# EAGLE design eagle_eagle_Tiltaudio_3.6 (EAGLE 7.3.0)
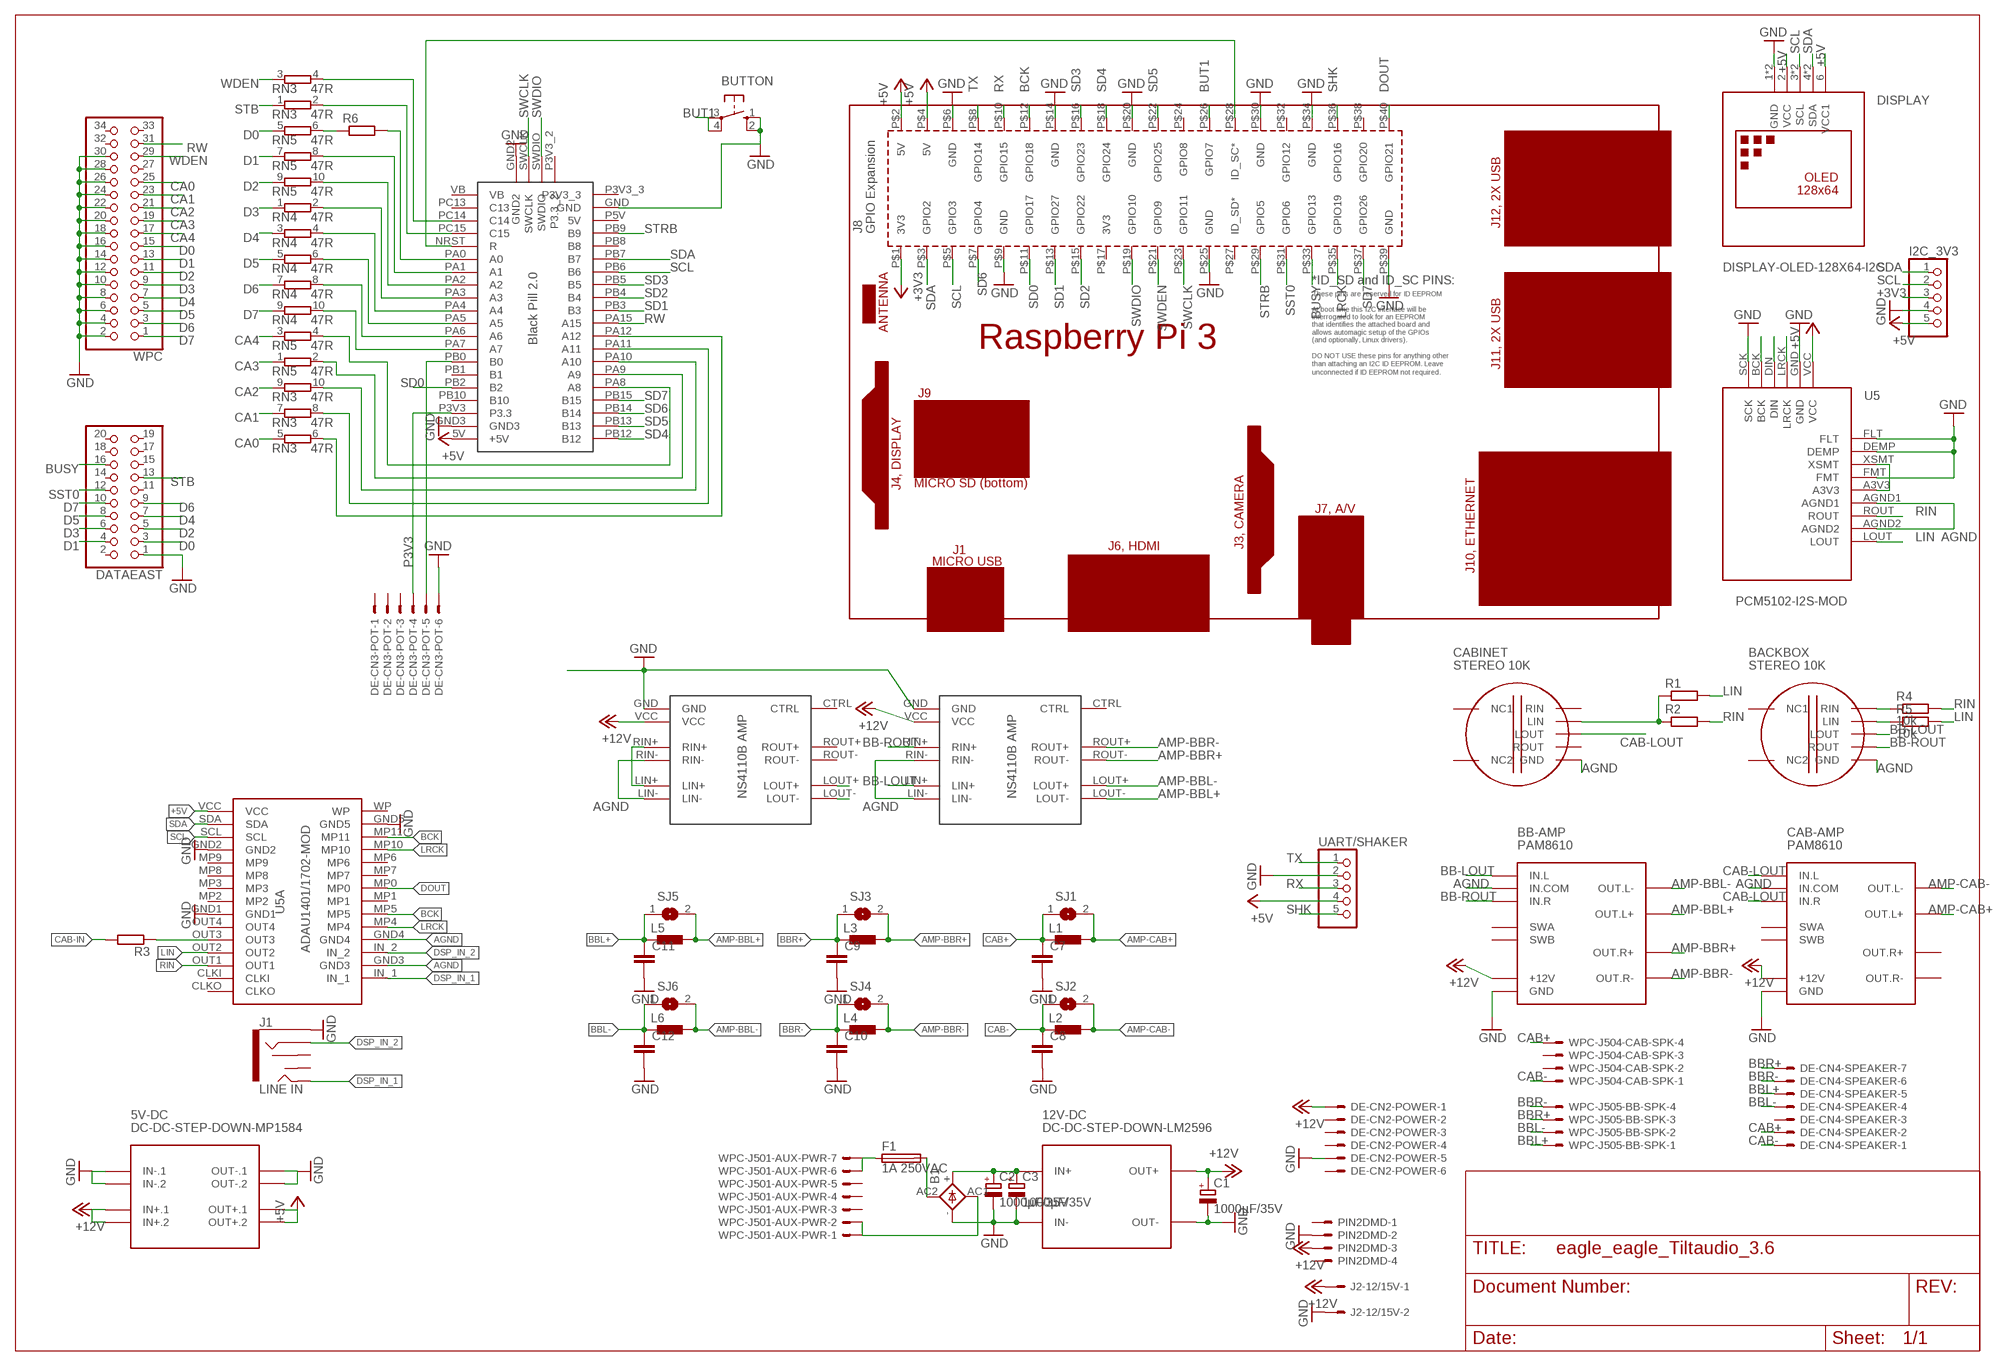
[diagram p0: schematic, sheet 1]

## Parts
5V-DC  DC-DC-STEP-DOWN-MP1584  [DC-DC-STEP-DOWN-MP1584]
12V-DC  DC-DC-STEP-DOWN-LM2596  [DC-DC-STEP-DOWN-LM2596]
B1  KBL  [KBL]
BACKBOX  STEREO 10K  UXCELL-STEREO-POTENTIOMETER  [UXCELL-STEREO-POTENTIOMETER]
BB-AMP  PAM8610  AMPLIFIER-PAM8610  [AMPLIFIER-PAM8610]
BUTTON  10-XX  [B3F-10XX]
C1  1000µF/35V  CPOL-EUE5-13  [E5-13]
C2  1000µF/35V  CPOL-EUE5-13  [E5-13]
C3  1000µF/35V  CPOL-EUE5-13  [E5-13]
C7  C-EU050-025X075  [C050-025X075]
C8  C-EU050-025X075  [C050-025X075]
C9  C-EU050-025X075  [C050-025X075]
C10  C-EU050-025X075  [C050-025X075]
C11  C-EU050-025X075  [C050-025X075]
C12  C-EU050-025X075  [C050-025X075]
CAB-AMP  PAM8610  AMPLIFIER-PAM8610  [AMPLIFIER-PAM8610]
CABINET  STEREO 10K  UXCELL-STEREO-POTENTIOMETER  [UXCELL-STEREO-POTENTIOMETER]
DATAEAST  PINHD-2X10  [2X10]
DE-CN2-POWER  KK-156-6  [KK-156-6]
DE-CN3-POT  KK-156-6  [KK-156-6]
DE-CN4-SPEAKER  KK-156-7  [KK-156-7]
DISPLAY  DISPLAY-OLED-128X64-I2C  [DISPLAY-OLED-128X64-I2C]
F1  1A 250VAC  FUSESHK20L  [SHK20L]
I2C_3V3  PINHD-1X5  [1X05]
J1  LINE IN  AUDIO_JACK_3.5MM_PTH  [AUDIO-JACK]
J2-12/15V  KK-156-2  [KK-156-2]
L1  BL02RN1  [BL02RN1]
L2  BL02RN1  [BL02RN1]
L3  BL02RN1  [BL02RN1]
L4  BL02RN1  [BL02RN1]
L5  BL02RN1  [BL02RN1]
L6  BL02RN1  [BL02RN1]
MPU1  Raspberry Pi3  RPI3RPI3MIRROR  [RPI3MIRROR]
PIN2DMD  KK-156-4  [KK-156-4]
R1  R-EU_0207/10  [0207/10]
R2  R-EU_0207/10  [0207/10]
R3  R-EU_0207/10  [0207/10]
R4  10k  R-EU_0207/10  [0207/10]
R5  10k  R-EU_0207/10  [0207/10]
R6  R-EU_0207/12  [0207/12]
RN3  47R  E5RP  [SIL10]
RN4  47R  E5RP  [SIL10]
RN5  47R  E5RP  [SIL10]
SJ1  SJ  [SJ]
SJ2  SJ  [SJ]
SJ3  SJ  [SJ]
SJ4  SJ  [SJ]
SJ5  SJ  [SJ]
SJ6  SJ  [SJ]
U5  PCM5102-I2S-MOD  [PCM5102-I2S-MOD]
U5A  ADAU1401/1702-MOD  [ADAU1401/1701-MOD]
U$1  STM32F411CE-BLACKPILL  [DIL40]
U$2  DAMP  [DAMP]
U$3  DAMP  [DAMP]
UART/SHAKER  PINHD-1X5  [1X05]
WPC  PINHD-2X17  [2X17]
WPC-J501-AUX-PWR  KK-156-7  [KK-156-7]
WPC-J504-CAB-SPK  KK-156-4  [KK-156-4]
WPC-J505-BB-SPK  KK-156-4  [KK-156-4]

## Nets
+3V3: I2C_3V3.3 MPU1.P$1(3V3)
+5V: 5V-DC.OUT+.1 5V-DC.OUT+.2 DISPLAY.2(VCC) DISPLAY.6(VCC1) I2C_3V3.5 MPU1.P$2(5V) MPU1.P$4(5V) U5.VCC U5A.VCC U$1.5V(+5V) UART/SHAKER.4
+12V: 5V-DC.IN+.1 5V-DC.IN+.2 12V-DC.OUT+ BB-AMP.+12V C1.+ CAB-AMP.+12V DE-CN2-POWER.1 J2-12/15V.1 PIN2DMD.3 U$2.VCC U$3.VCC
AGND: BACKBOX.GND BB-AMP.IN.COM CAB-AMP.IN.COM CABINET.GND U5.AGND1 U5.AGND2 U5A.GND3 U5A.GND4 U$2.LIN- U$2.RIN- U$3.LIN- U$3.RIN-
AMP-BBL+: BB-AMP.OUT.L+ L5.2 SJ5.2 U$2.LOUT-
AMP-BBL-: BB-AMP.OUT.L- L6.2 SJ6.2 U$2.LOUT+
AMP-BBR+: BB-AMP.OUT.R+ L3.2 SJ3.2 U$2.ROUT-
AMP-BBR-: BB-AMP.OUT.R- L4.2 SJ4.2 U$2.ROUT+
AMP-CAB+: CAB-AMP.OUT.L+ L1.2 SJ1.2 U$3.LOUT-
AMP-CAB-: CAB-AMP.OUT.L- L2.2 SJ2.2 U$3.LOUT+
BB-LIN: BACKBOX.LIN R5.1
BB-LOUT: BACKBOX.LOUT BB-AMP.IN.L U$2.LIN+
BB-RIN: BACKBOX.RIN R4.1
BB-ROUT: BACKBOX.ROUT BB-AMP.IN.R U$2.RIN+
BBL+: C11.1 DE-CN4-SPEAKER.5 L5.1 SJ5.1 WPC-J505-BB-SPK.1
BBL-: C12.1 DE-CN4-SPEAKER.4 L6.1 SJ6.1 WPC-J505-BB-SPK.2
BBR+: C9.1 DE-CN4-SPEAKER.7 L3.1 SJ3.1 WPC-J505-BB-SPK.3
BBR-: C10.1 DE-CN4-SPEAKER.6 L4.1 SJ4.1 WPC-J505-BB-SPK.4
BCK: MPU1.P$12(GPIO18) U5.BCK U5A.MP5 U5A.MP11
BUSY: DATAEAST.16 MPU1.P$33(GPIO13)
BUT1: BUTTON.3(P) BUTTON.4(P1) MPU1.P$26(GPIO7)
CA0: RN3.5 WPC.25
CA1: RN3.7 WPC.23
CA2: RN3.9 WPC.21
CA3: RN5.1 WPC.19
CA4: RN5.3 WPC.17
CAB+: C7.1 DE-CN4-SPEAKER.2 L1.1 SJ1.1 WPC-J504-CAB-SPK.4
CAB-: C8.1 DE-CN4-SPEAKER.1 L2.1 SJ2.1 WPC-J504-CAB-SPK.1
CAB-IN: CABINET.LIN R1.1 R2.1 R3.2
CAB-LOUT: CAB-AMP.IN.L CAB-AMP.IN.R CABINET.LOUT U$3.LIN+ U$3.RIN+
D0: DATAEAST.3 RN5.5 WPC.15
D1: DATAEAST.4 RN5.7 WPC.13
D2: DATAEAST.5 RN5.9 WPC.11
D3: DATAEAST.6 RN4.1 WPC.9
D4: DATAEAST.7 RN4.3 WPC.7
D5: DATAEAST.8 RN4.5 WPC.5
D6: DATAEAST.9 RN4.7 WPC.3
D7: DATAEAST.10 RN4.9 WPC.1
DOUT: MPU1.P$40(GPIO21) U5.DIN U5A.MP0
DSP_IN_1: J1.TIP U5A.IN_1
DSP_IN_2: J1.RING U5A.IN_2
GND: 5V-DC.IN-.1 5V-DC.IN-.2 5V-DC.OUT-.1 5V-DC.OUT-.2 12V-DC.IN- 12V-DC.OUT- B1.- BB-AMP.GND BUTTON.1(S) BUTTON.2(S1) C1.- C2.- C3.- C7.2 C8.2 C9.2 C10.2 C11.2 C12.2 CAB-AMP.GND DATAEAST.1 DE-CN2-POWER.5 DE-CN3-POT.6 DISPLAY.1(GND) DISPLAY.5(GND) I2C_3V3.4 J1.SLEEVE J2-12/15V.2 MPU1.P$6(GND) MPU1.P$9(GND) MPU1.P$14(GND) MPU1.P$20(GND) MPU1.P$25(GND) MPU1.P$30(GND) MPU1.P$34(GND) MPU1.P$39(GND) PIN2DMD.2 U5.DEMP U5.FLT U5.FMT U5.GND U5.SCK U5A.GND1 U5A.GND2 U5A.GND5 U$1.GND U$1.GND2 U$1.GND3 U$2.GND U$3.GND UART/SHAKER.2 WPC.2 WPC.4 WPC.6 WPC.8 WPC.10 WPC.12 WPC.14 WPC.16 WPC.18 WPC.20 WPC.22 WPC.24 WPC.26 WPC.28 WPC.30
LIN: R1.2 R5.2 U5.LOUT U5A.OUT2
LRCK: MPU1.P$35(GPIO19) U5.LRCK U5A.MP4 U5A.MP10
N$1: MPU1.P$28(ID_SC*) U$1.NRST(R)
N$2: R3.1 U5A.OUT3
N$3: RN3.4 U$1.PC14(C14)
N$4: U5.A3V3 U5.XSMT
N$5: RN3.2 U$1.PC15(C15)
N$6: R6.2 U$1.PA0(A0)
N$7: RN5.8 U$1.PA1(A1)
N$8: RN5.10 U$1.PA2(A2)
N$9: B1.AC2(AC1) F1.2A
N$10: F1.1A WPC-J501-AUX-PWR.6 WPC-J501-AUX-PWR.7
N$11: B1.AC1(AC2) WPC-J501-AUX-PWR.1 WPC-J501-AUX-PWR.2
N$12: RN4.2 U$1.PA3(A3)
N$13: RN4.4 U$1.PA4(A4)
N$14: RN4.6 U$1.PA5(A5)
N$15: RN4.8 U$1.PA6(A6)
N$16: RN4.10 U$1.PA7(A7)
N$17: RN3.6 U$1.PA12(A12)
N$18: RN5.4 U$1.PA8(A8)
N$19: RN3.8 U$1.PA11(A11)
N$20: RN3.10 U$1.PA10(A10)
N$21: RN5.2 U$1.PA9(A9)
N$22: DE-CN3-POT.5 U$1.PB0(B0)
N$23: R6.1 RN5.6
N$26: 12V-DC.IN+ B1.+ C2.+ C3.+
P3V3: DE-CN3-POT.4 U$1.P3V3(P3.3)
RIN: R2.2 R4.2 U5.ROUT U5A.OUT1
RW: U$1.PA15(A15) WPC.31
RX: MPU1.P$10(GPIO15) UART/SHAKER.3
SCL: DISPLAY.3(SCL) DISPLAY.7(SCL) I2C_3V3.2 MPU1.P$5(GPIO3) U5A.SCL U$1.PB6(B6)
SD0: MPU1.P$11(GPIO17) U$1.PB2(B2)
SD1: MPU1.P$13(GPIO27) U$1.PB3(B3)
SD2: MPU1.P$15(GPIO22) U$1.PB4(B4)
SD3: MPU1.P$16(GPIO23) U$1.PB5(B5)
SD4: MPU1.P$18(GPIO24) U$1.PB12(B12)
SD5: MPU1.P$22(GPIO25) U$1.PB13(B13)
SD6: MPU1.P$7(GPIO4) U$1.PB14(B14)
SD7: MPU1.P$37(GPIO26) U$1.PB15(B15)
SDA: DISPLAY.4(SDA) DISPLAY.8(SDA) I2C_3V3.1 MPU1.P$3(GPIO2) U5A.SDA U$1.PB7(B7)
SHK: MPU1.P$36(GPIO16) UART/SHAKER.5
SST0: DATAEAST.12 MPU1.P$31(GPIO6)
STB: DATAEAST.13 RN3.1
STRB: MPU1.P$29(GPIO5) U$1.PB9(B9)
SWCLK: MPU1.P$23(GPIO11) U$1.SWCLK
SWDEN: MPU1.P$21(GPIO9)
SWDIO: MPU1.P$19(GPIO10) U$1.SWDIO
TX: MPU1.P$8(GPIO14) UART/SHAKER.1
WDEN: RN3.3 WPC.29
Unconnected: BACKBOX.NC1 BACKBOX.NC2 BB-AMP.SWA BB-AMP.SWB CAB-AMP.OUT.R+ CAB-AMP.OUT.R- CAB-AMP.SWA CAB-AMP.SWB CABINET.NC1 CABINET.NC2 CABINET.RIN CABINET.ROUT DATAEAST.2 DATAEAST.11 DATAEAST.14 DATAEAST.15 DATAEAST.17 DATAEAST.18 DATAEAST.19 DATAEAST.20 DE-CN2-POWER.2 DE-CN2-POWER.3 DE-CN2-POWER.4 DE-CN2-POWER.6 DE-CN3-POT.1 DE-CN3-POT.2 DE-CN3-POT.3 DE-CN4-SPEAKER.3 J1.RSH J1.TSH MPU1.P$17(3V3) MPU1.P$24(GPIO8) MPU1.P$27(ID_SD*) MPU1.P$32(GPIO12) MPU1.P$38(GPIO20) PIN2DMD.1 PIN2DMD.4 U5A.CLKI U5A.CLKO U5A.MP1 U5A.MP2 U5A.MP3 U5A.MP6 U5A.MP7 U5A.MP8 U5A.MP9 U5A.OUT4 U5A.WP U$1.P3V3_2(P3.3_2) U$1.P3V3_3 U$1.P5V(5V) U$1.PB1(B1) U$1.PB8(B8) U$1.PB10(B10) U$1.PC13(C13) U$1.VB U$2.CTRL U$3.CTRL U$3.ROUT+ U$3.ROUT- WPC-J501-AUX-PWR.3 WPC-J501-AUX-PWR.4 WPC-J501-AUX-PWR.5 WPC-J504-CAB-SPK.2 WPC-J504-CAB-SPK.3 WPC.27 WPC.32 WPC.33 WPC.34

## Library data of the parts
5V-DC = diy-modules:DC-DC-STEP-DOWN-MP1584: DC/DC Step-Down Regulator based on MP1584 chip MP1584 datasheet available here: http://www.haoyuelectronics.com/Attachment/MP1584/MP1584.pdf Click here to find device on ebay.com <http://www.ebay.com/sch/mp1584+module>
12V-DC = diy-modules:DC-DC-STEP-DOWN-LM2596: DC/DC Step-Down Regulator based on LM2596-ADJ chip LM2596 datasheet available here: http://www.ti.com/lit/ds/symlink/lm2596.pdf Click here to find device on ebay.com <http://www.ebay.com/sch/lm2596+power+regulator>
B1 = rectifier:KBL: DIOTEC RECTIFIER
BACKBOX CABINET = diy-modules:UXCELL-STEREO-POTENTIOMETER: UXCELL STEREO POTENTIOMETER
BB-AMP CAB-AMP = diy-modules:AMPLIFIER-PAM8610: Stereo Audio Amplifier based on PAM8610 chip
BUTTON = switch-omron:10-XX: OMRON SWITCH; MPN: B3F-1000; OC_FARNELL: 176432; OC_NEWARK: 36M3542
C1-C3 = rcl:CPOL-EU: POLARIZED CAPACITOR, European symbol
C7-C12 = rcl:C-EU: CAPACITOR, European symbol
DATAEAST = pinhead:PINHD-2X10: PIN HEADER
DE-CN2-POWER DE-CN3-POT = con-molex:KK-156-6: KK 156 HEADER Source: http://www.molex.com/pdm_docs/sd/026604100_sd.pdf; OC_FARNELL: unknown; OC_NEWARK: unknown
DE-CN4-SPEAKER WPC-J501-AUX-PWR = con-molex:KK-156-7: KK 156 HEADER Source: http://www.molex.com/pdm_docs/sd/026604100_sd.pdf; OC_FARNELL: unknown; OC_NEWARK: unknown
DISPLAY = diy-modules:DISPLAY-OLED-128X64-I2C: 128x64 Dot Matrix OLED Module based on SSD1306 chip Variant with I2C interface More details available here: http://www.instructables.com/id/Monochrome-096-i2c-OLED-display-with-arduino-SSD13/ SSD1306 datasheet: https://cdn-shop.adafruit.com/datasheets/SSD1306.pdf Click here to find device on ebay.com <http://www.ebay.com/sch/oled+display+128x64+iic> Note: There are two variants: I2C and SPI. Search for the proper version.
F1 = fuse:FUSE: Fuse; OC_FARNELL: unknown; OC_NEWARK: unknown
I2C_3V3 UART/SHAKER = pinhead:PINHD-1X5: PIN HEADER
J1 = SparkFun-Connectors:AUDIO_JACK_3.5MM: Audio Jack 3.5mm variants of PTH and SMT stereo audio jack with bypass switches. SparkFun Products: SparkFun SparkPunk Sound Kit <[https://www.sparkfun.com/products/11177]> - PTH MP3 Trigger <https://www.sparkfun.com/products/13720> -3.5mm SMD SparkFun PicoBoard <https://www.sparkfun.com/products/11888>- 2.5mm SMD; PROD_ID: CONN-08774; SF_ID: PRT-08032
J2-12/15V = con-molex:KK-156-2: KK 156 HEADER Source: http://www.molex.com/pdm_docs/sd/026604100_sd.pdf; OC_FARNELL: unknown; OC_NEWARK: unknown
L1-L6 = inductors:BL0: Noise Suppression Products/EMI Suppression Filters, Lead EMIFIL(R) Inductor Type Source: http://www.murata.com .. BL01RN1_DS.pdf
MPU1 = e14_Rpi3_RevA+mirror-pcb:RPI3: Device for Raspberry Pi 3 board created by Dave Young for www.element14.com More information and support community is available at https://www.element14.com/community/community/raspberry-pi Device for Raspberry Pi 3 board updated by Gerald Schwarz for www.element14.com On RPI3 addet the layer milling and created a mirrored shield.
PIN2DMD WPC-J504-CAB-SPK WPC-J505-BB-SPK = con-molex:KK-156-4: KK 156 HEADER Source: http://www.molex.com/pdm_docs/sd/026604100_sd.pdf; OC_FARNELL: unknown; OC_NEWARK: unknown
R1-R6 = rcl:R-EU_: RESISTOR, European symbol
RN3-RN5 = resistor-sil:E5RP: SIL RESISTOR; OC_FARNELL: unknown; OC_NEWARK: unknown
SJ1-SJ6 = jumper:SJ: SMD solder JUMPER
U5 = diy-modules:PCM5102-I2S-MOD: PCM5102-I2S-MOD
U5A = diy-modules:ADAU1401/1702-MOD: ADAU1401/1702-MOD
U$1 = diy-modules2:STM32F411CE-BLACKPILL: Black Pill 2.0 siehe https://stm32-base.org/boards/STM32F411CEU6-WeAct-Black-Pill-V2.0.html
U$2 U$3 = diy-modules:DAMP: Differential Amplifier Board 2x18W Digital Class D/Class AB Audio Power Amplifier NS4110B Voltage 6-14V https://www.aliexpress.com/item/1005001678028453.html
WPC = pinhead:PINHD-2X17: PIN HEADER

## Board
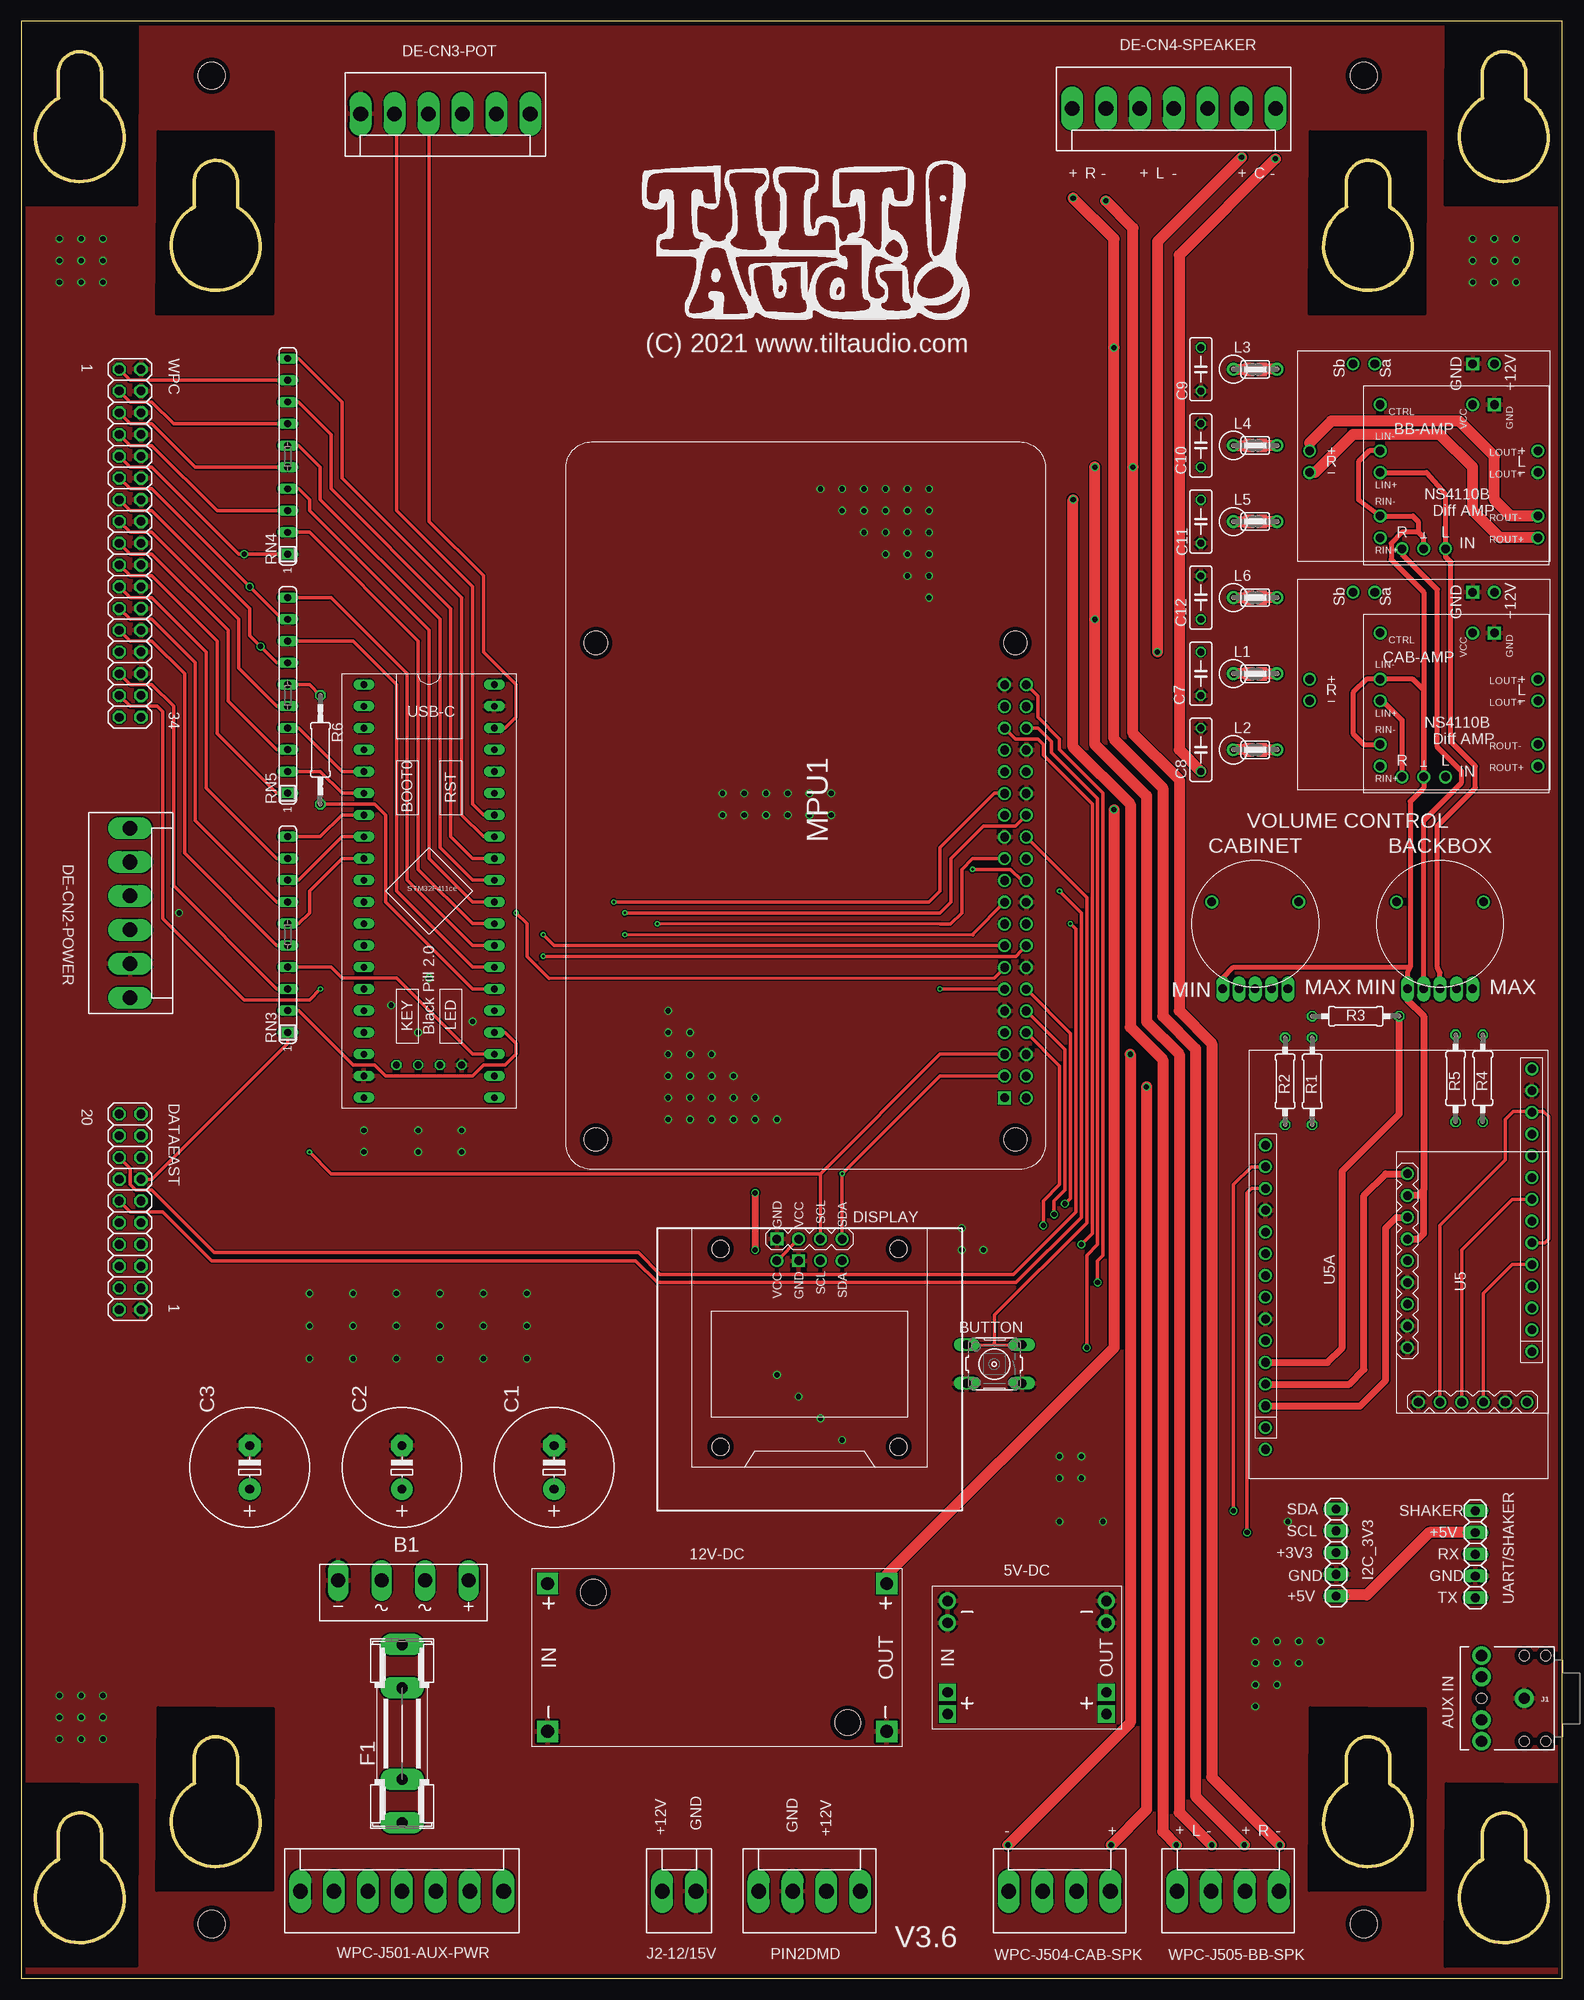
[diagram p1: board, top side]
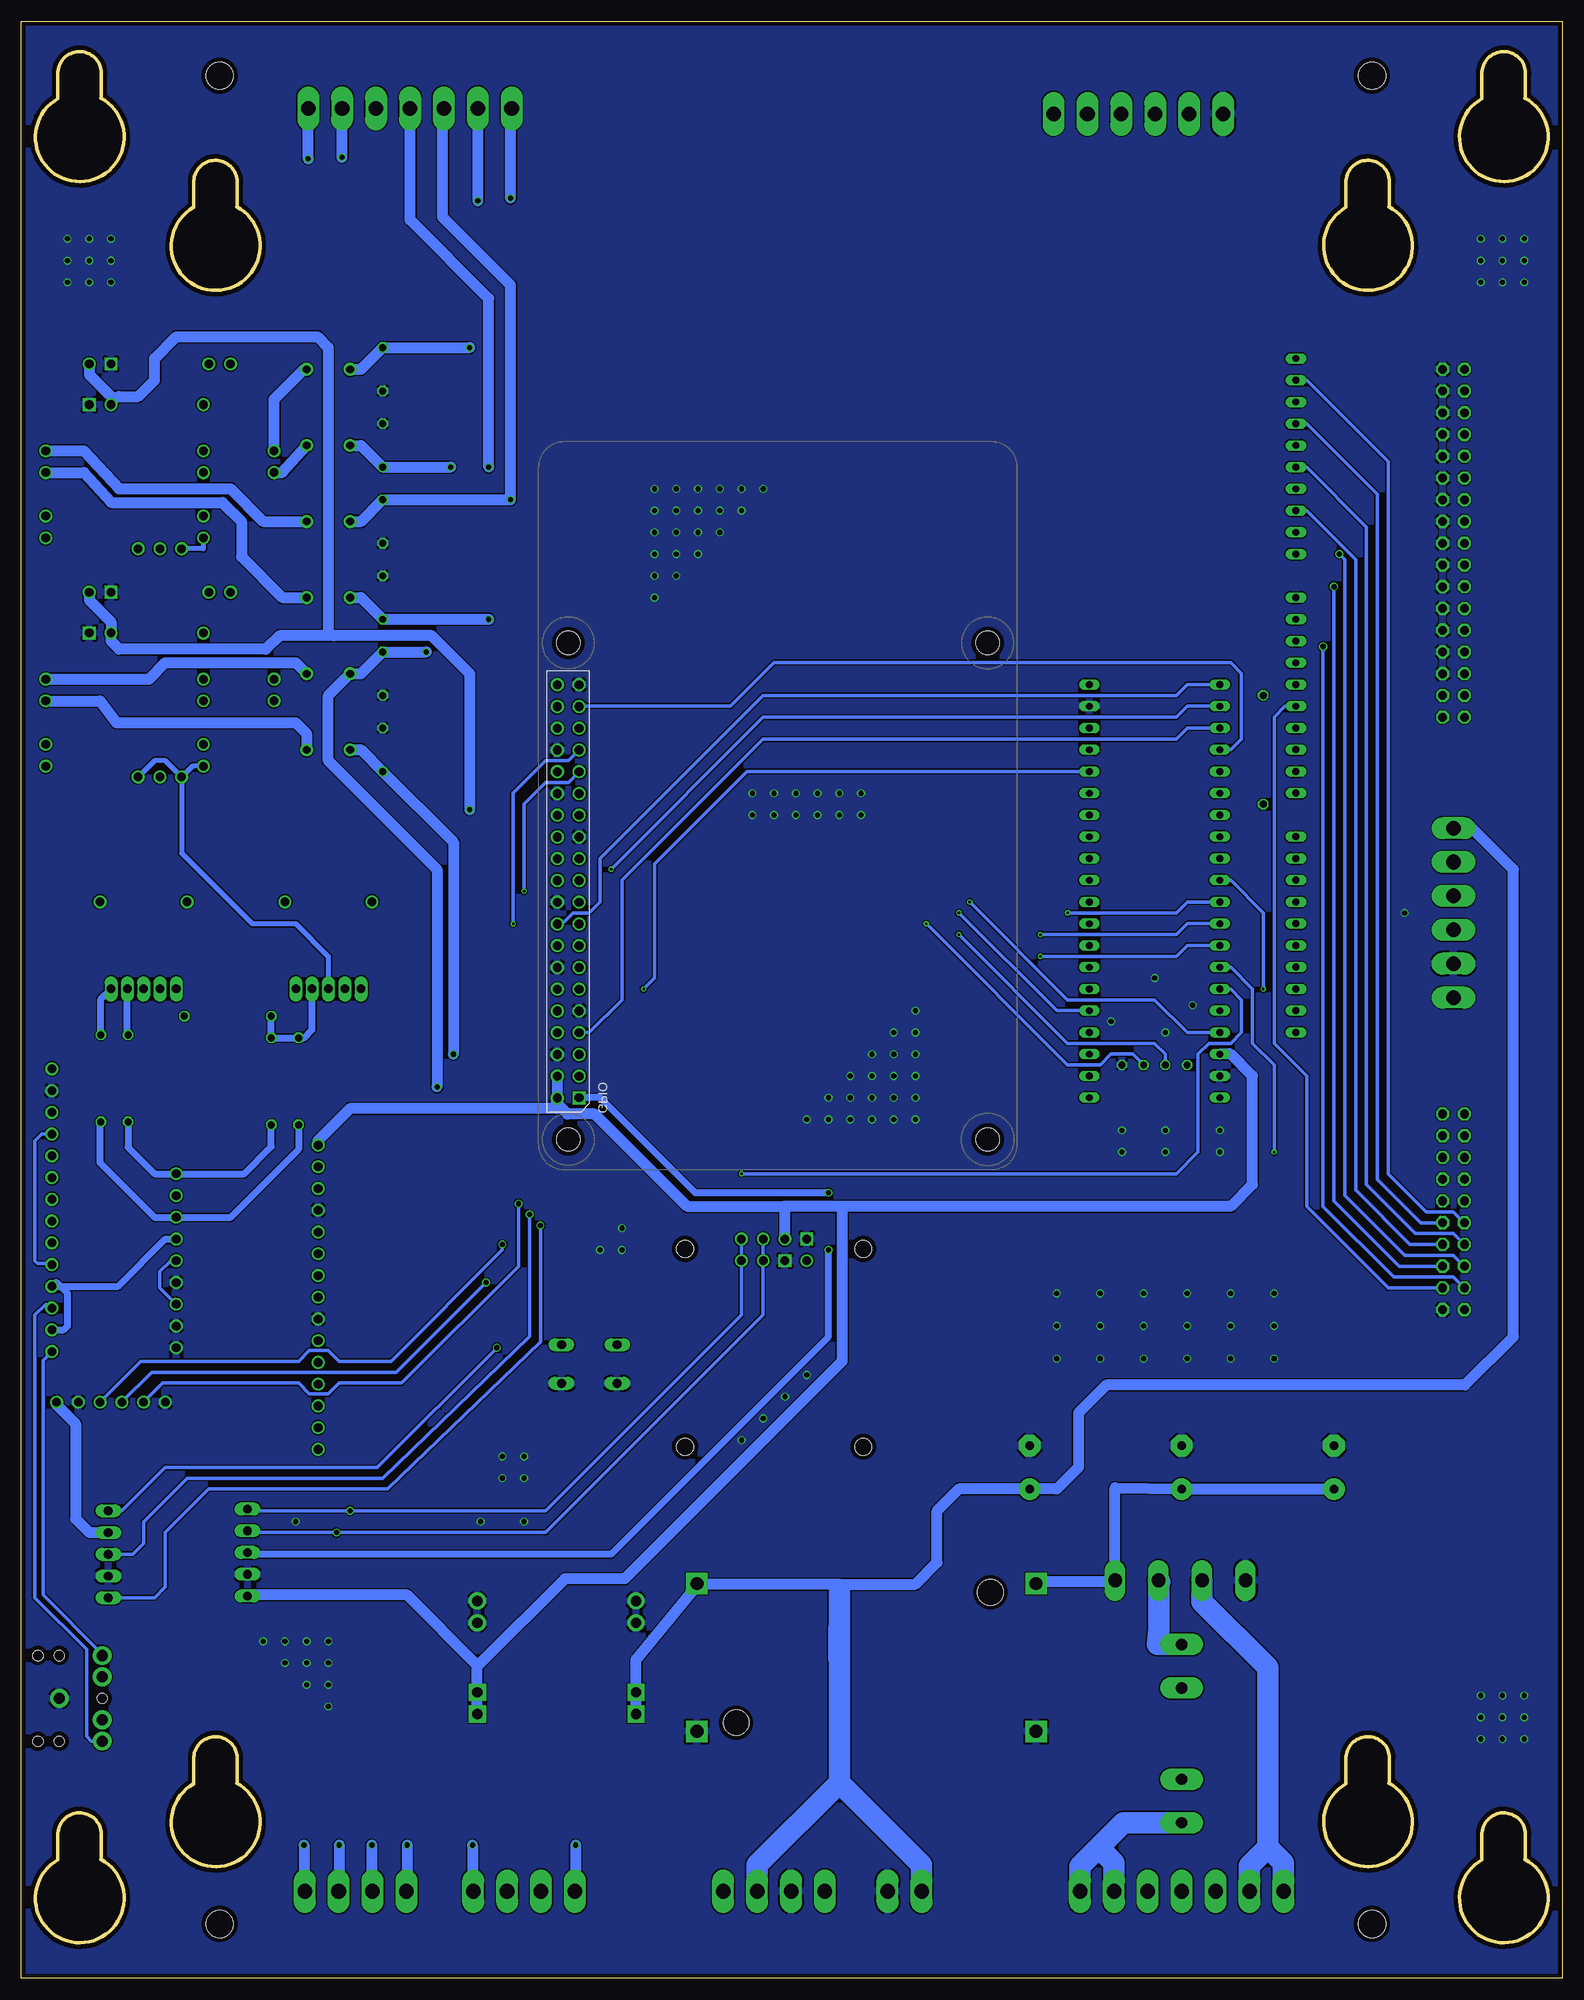
[diagram p2: board, bottom side, seen from below]

Size 180.01 x 228.58 mm. Coordinates in mm from the lower left corner, seen from the top.
Outline: 154.8,206.92 154.8,209.84 arc-181 159.88,209.72 159.88,206.92
Outline: 159.88,206.86 arc-302 154.86,206.92
Outline: 154.8,22.77 154.8,25.69 arc-181 159.88,25.57 159.88,22.77
Outline: 159.88,22.71 arc-302 154.86,22.77
Outline: 20.18,22.77 20.18,25.69 arc-181 25.26,25.57 25.26,22.77
Outline: 25.26,22.71 arc-302 20.24,22.77
Outline: 20.18,206.92 20.18,209.84 arc-181 25.26,209.72 25.26,206.92
Outline: 25.26,206.86 arc-302 20.24,206.92
Outline: 4.3,219.62 4.3,222.54 arc-181 9.38,222.42 9.38,219.62
Outline: 9.38,219.56 arc-302 4.37,219.62
Outline: 170.67,219.62 170.67,222.54 arc-181 175.75,222.42 175.75,219.62
Outline: 175.75,219.56 arc-302 170.74,219.62
Outline: 170.67,13.88 170.67,16.8 arc-181 175.75,16.68 175.75,13.88
Outline: 175.75,13.82 arc-302 170.74,13.88
Outline: 4.3,13.88 4.3,16.8 arc-181 9.38,16.68 9.38,13.88
Outline: 9.38,13.82 arc-302 4.37,13.88
Outline: 0,228.58 0,0 180.01,0 180.01,228.58 0,228.58
Copper layers (1*16): Top 0.035mm / dielectric 1.5mm / Bottom 0.035mm
Design rules "default *": minimum track width 6mil, minimum drill 12mil, track to track 6mil, track to pad 6mil, pad to pad 6mil, via to via 8mil, smd to smd 0mil, copper to edge 20mil, drill to drill 10mil, minimum pad ring 6mil, minimum via ring 6mil, stop-mask expansion 4mil, vias tented up to drill 0mil, thermal gap 10mil
Holes 3.2 mm at 22.23,6.33 22.23,222.23 156.84,222.23 156.84,6.33
tRestrict: area 150.5,194.4 to 164,215.7; area 150.5,10.3 to 164,31.6; area 15.8,10.3 to 29.4,31.6; area 15.8,194.4 to 29.4,215.7; area 0,207.1 to 13.5,228.4; area 166.3,207.1 to 179.9,228.4; area 166.3,1.4 to 179.9,22.7; area 0,1.4 to 13.5,22.7

### Footprints (pad centres in the part's own frame; a part is rotated, then mirrored left to right if it is on the bottom)
DC-DC-STEP-DOWN-MP1584 = drill 1.2 pad 2 square: IN+.1 -9.271,-4.064; IN+.2 -9.271,-6.604; OUT+.1 9.271,-4.064; OUT+.2 9.271,-6.604 | drill 1.2 pad 2: IN-.1 -9.271,6.604; IN-.2 -9.271,4.064; OUT-.1 9.271,6.604; OUT-.2 9.271,4.064
DC-DC-STEP-DOWN-LM2596 = drill 1.5 pad 2.5 square: IN+ -19.812,8.636; IN- -19.812,-8.636; OUT+ 19.812,8.636; OUT- 19.812,-8.636 | hole 3: -14.478,7.62; 15.24,-7.62
KBL = drill 1.6 long: + -7.62,-1.27; - 7.62,-1.27; AC1 2.54,-1.27; AC2 -2.54,-1.27
UXCELL-STEREO-POTENTIOMETER = drill 1 long: GND 8.255,-3.81; LIN 8.255,1.905; LOUT 8.255,0; RIN 8.255,3.81; ROUT 8.255,-1.905 | drill 1: NC1 -1.905,5.08; NC2 -1.905,-5.08
AMPLIFIER-PAM8610 = drill 1: +12V 9.525,8.89; IN.COM 1.27,-12.7; IN.L 3.81,-12.7; IN.R -1.27,-12.7; OUT.L+ 14.605,-1.27; OUT.L- 14.605,-3.81; OUT.R+ -12.065,-1.27; OUT.R- -12.065,-3.81; SWA -4.445,8.89; SWB -6.985,8.89 | drill 1 square: GND 6.985,8.89
B3F-10XX = drill 1.016 long: 1 -3.251,2.261; 2 3.251,2.261; 3 -3.251,-2.261; 4 3.251,-2.261
E5-13 = drill 1.016 pad 2.54: + -2.54,0 | drill 1.016 pad 2.54 octagon: - 2.54,0
C050-025X075 = drill 0.813 octagon: 1 -2.54,0; 2 2.54,0
2X10 = drill 1.016 octagon: 1 -11.43,-1.27; 2 -11.43,1.27; 3 -8.89,-1.27; 4 -8.89,1.27; 5 -6.35,-1.27; 6 -6.35,1.27; 7 -3.81,-1.27; 8 -3.81,1.27; 9 -1.27,-1.27; 10 -1.27,1.27; 11 1.27,-1.27; 12 1.27,1.27; 13 3.81,-1.27; 14 3.81,1.27; 15 6.35,-1.27; 16 6.35,1.27; 17 8.89,-1.27; 18 8.89,1.27; 19 11.43,-1.27; 20 11.43,1.27
KK-156-6 = drill 1.7 pad 2.184 long: 1 -9.9,0; 2 -5.94,0; 3 -1.98,0; 4 1.98,0; 5 5.94,0; 6 9.9,0
KK-156-7 = drill 1.7 pad 2.184 long: 1 -11.88,0; 2 -7.92,0; 3 -3.96,0; 4 0,0; 5 3.96,0; 6 7.92,0; 7 11.88,0
DISPLAY-OLED-128X64-I2C = drill 1 square: 1 -3.81,12.7; 5 -1.27,10.16 | drill 1: 2 -1.27,12.7; 3 1.27,12.7; 4 3.81,12.7; 6 -3.81,10.16; 7 1.27,10.16; 8 3.81,10.16 | hole 2: -10.414,11.557; 10.414,11.557; 10.414,-11.557; -10.414,-11.557
SHK20L = drill 1.321 pad 2.54 long: 1A -10.414,0; 1B -5.334,0; 2A 10.414,0; 2B 5.334,0
1X05 = drill 1.016 long: 1 -5.08,0; 2 -2.54,0; 3 0,0; 4 2.54,0; 5 5.08,0
AUDIO-JACK = drill 1.3 pad 2.184: RING 5,5; RSH 5,2.5; SLEEVE 0,0; TIP 5,-5; TSH 5,-2.5 | hole 1.2: 0,5; -2.5,5; -2.5,-5; 0,-5; 5,0
KK-156-2 = drill 1.7 pad 2.184 long: 1 -1.98,0; 2 1.98,0
BL02RN1 = drill 0.9 pad 1.5: 1 -2.54,0; 2 2.54,0
RPI3MIRROR = drill 1.016 square: P$1 8.37,4.775 | drill 1.016: P$2 8.357,2.233; P$3 10.897,4.773; P$4 10.897,2.233; P$5 13.437,4.773; P$6 13.437,2.233; P$7 15.977,4.773; P$8 15.977,2.233; P$9 18.517,4.773; P$10 18.517,2.233; P$11 21.057,4.773; P$12 21.057,2.233; P$13 23.597,4.773; P$14 23.597,2.233; P$15 26.137,4.773; P$16 26.137,2.233; P$17 28.677,4.773; P$18 28.677,2.233; P$19 31.217,4.773; P$20 31.217,2.233; P$21 33.757,4.773; P$22 33.757,2.233; P$23 36.297,4.773; P$24 36.297,2.233; P$25 38.837,4.773; P$26 38.837,2.233; P$27 41.377,4.773; P$28 41.377,2.233; P$29 43.917,4.773; P$30 43.917,2.233; P$31 46.457,4.773; P$32 46.457,2.233; P$33 48.997,4.773; P$34 48.997,2.233; P$35 51.537,4.773; P$36 51.537,2.233; P$37 54.077,4.773; P$38 54.077,2.233; P$39 56.617,4.773; P$40 56.617,2.233 | hole 2.75: 3.5,52.505; 61.5,52.505; 3.5,3.505; 61.5,3.505
KK-156-4 = drill 1.7 pad 2.184 long: 1 -5.94,0; 2 -1.98,0; 3 1.98,0; 4 5.94,0
0207/10 = drill 0.813 octagon: 1 -5.08,0; 2 5.08,0
0207/12 = drill 0.813 octagon: 1 -6.35,0; 2 6.35,0
SIL10 = drill 0.813 long: 1 -11.43,0; 2 -8.89,0; 3 -6.35,0; 4 -3.81,0; 5 -1.27,0; 6 1.27,0; 7 3.81,0; 8 6.35,0; 9 8.89,0; 10 11.43,0
SJ = smd 1.168 x 1.6: 1 -0.762,0; 2 0.762,0
PCM5102-I2S-MOD = drill 1: A3V3 -2.54,-7.62; AGND1 -5.08,-7.62; AGND2 -10.16,-7.62; BCK 13.97,-3.81; DEMP 5.08,-7.62; DIN 13.97,-1.27; FLT 7.62,-7.62; FMT 0,-7.62; GND 13.97,3.81; LOUT -12.7,-7.62; LRCK 13.97,1.27; ROUT -7.62,-7.62; SCK 13.97,-6.35; VCC 13.97,6.35; XSMT 2.54,-7.62
ADAU1401/1701-MOD = drill 1: CLKI -15.557,-19.05; CLKO -15.557,-21.59; GND1 -15.557,-6.35; GND2 -15.557,6.35; GND3 15.557,-7.62; GND4 15.557,-2.54; GND5 15.557,20.32; IN_1 15.557,-10.16; IN_2 15.557,-5.08; MP0 15.557,7.62; MP1 15.557,5.08; MP2 -15.557,-3.81; MP3 -15.557,-1.27; MP4 15.557,0; MP5 15.557,2.54; MP6 15.557,12.7; MP7 15.557,10.16; MP8 -15.557,1.27; MP9 -15.557,3.81; MP10 15.557,15.24; MP11 15.557,17.78; OUT1 -15.557,-16.51; OUT2 -15.557,-13.97; OUT3 -15.557,-11.43; OUT4 -15.557,-8.89; SCL -15.557,8.89; SDA -15.557,11.43; VCC -15.557,13.97; WP 15.557,22.86
DIL40 = drill 0.8 long: 5V 19.05,-7.62; GND 21.59,-7.62; GND3 -21.59,7.62; NRST 13.97,7.62; P3V3 -19.05,7.62; P3V3_3 24.13,-7.62; P5V -24.13,7.62; PA0 11.43,7.62; PA1 8.89,7.62; PA2 6.35,7.62; PA3 3.81,7.62; PA4 1.27,7.62; PA5 -1.27,7.62; PA6 -3.81,7.62; PA7 -6.35,7.62; PA8 -13.97,-7.62; PA9 -11.43,-7.62; PA10 -8.89,-7.62; PA11 -6.35,-7.62; PA12 -3.81,-7.62; PA15 -1.27,-7.62; PB0 -8.89,7.62; PB1 -11.43,7.62; PB2 -13.97,7.62; PB3 1.27,-7.62; PB4 3.81,-7.62; PB5 6.35,-7.62; PB6 8.89,-7.62; PB7 11.43,-7.62; PB8 13.97,-7.62; PB9 16.51,-7.62; PB10 -16.51,7.62; PB12 -24.13,-7.62; PB13 -21.59,-7.62; PB14 -19.05,-7.62; PB15 -16.51,-7.62; PC13 21.59,7.62; PC14 19.05,7.62; PC15 16.51,7.62; VB 24.13,7.62 | drill 0.8 octagon: GND2 20.32,3.81; P3V3_2 20.32,-3.81; SWCLK 20.32,1.27; SWDIO 20.32,-1.27
DAMP = drill 1: CTRL 1.905,18.733; LIN+ 1.905,10.795; LIN- 1.905,13.335; LOUT+ 20.32,10.795; LOUT- 20.32,13.335; RIN+ 1.905,3.175; RIN- 1.905,5.715; ROUT+ 20.32,3.175; ROUT- 20.32,5.715; VCC 12.7,18.733 | drill 1 square: GND 15.24,18.733
2X17 = drill 1.016 octagon: 1 -20.32,-1.27; 2 -20.32,1.27; 3 -17.78,-1.27; 4 -17.78,1.27; 5 -15.24,-1.27; 6 -15.24,1.27; 7 -12.7,-1.27; 8 -12.7,1.27; 9 -10.16,-1.27; 10 -10.16,1.27; 11 -7.62,-1.27; 12 -7.62,1.27; 13 -5.08,-1.27; 14 -5.08,1.27; 15 -2.54,-1.27; 16 -2.54,1.27; 17 0,-1.27; 18 0,1.27; 19 2.54,-1.27; 20 2.54,1.27; 21 5.08,-1.27; 22 5.08,1.27; 23 7.62,-1.27; 24 7.62,1.27; 25 10.16,-1.27; 26 10.16,1.27; 27 12.7,-1.27; 28 12.7,1.27; 29 15.24,-1.27; 30 15.24,1.27; 31 17.78,-1.27; 32 17.78,1.27; 33 20.32,-1.27; 34 20.32,1.27

### Placement (x,y rotation side)
5V-DC  117.48,37.45 0 top
12V-DC  81.28,37.45 0 top
B1  44.62,45.18 180 top
BACKBOX  165.73,123.81 270 top
BB-AMP  162.56,179.69 0 top
BUTTON  113.66,71.73 180 top
C1  62.23,59.67 90 top
C2  44.45,59.67 90 top
C3  26.67,59.67 90 top
C7  137.79,152.38 270 top
C8  137.79,143.49 90 top
C9  137.79,187.94 270 top
C10  137.79,179.05 90 top
C11  137.79,170.16 270 top
C12  137.79,161.27 90 top
CAB-AMP  162.56,153.01 0 top
CABINET  144.14,123.81 270 top
DATAEAST  12.7,89.52 90 top
DE-CN2-POWER  12.7,124.44 270 top
DE-CN3-POT  49.53,217.78 180 top
DE-CN4-SPEAKER  134.62,218.42 180 top
DISPLAY  92.08,73.64 0 top
F1  44.47,28.55 90 top
I2C_3V3  153.59,49.71 270 top
J1  175.58,32.68 180 top
J2-12/15V  76.84,10.14 0 top
L1  144.14,152.38 0 top
L2  144.14,143.49 0 top
L3  144.14,187.94 0 top
L4  144.14,179.05 0 top
L5  144.14,170.16 0 top
L6  144.14,161.27 0 top
MPU1  119.63,94.47 90 top
PIN2DMD  92.08,10.14 0 top
R1  150.81,104.76 270 top
R2  147.64,104.76 270 top
R3  155.89,112.38 180 top
R4  170.73,105.1 270 top
R5  167.56,105.1 270 top
R6  34.92,143.49 270 top
RN3  31.12,121.9 90 top
RN4  31.12,177.78 90 top
RN5  31.12,149.84 90 top
SJ1  144.14,152.38 0 top
SJ2  144.14,143.49 0 top
SJ3  144.14,187.94 0 top
SJ4  144.14,179.05 0 top
SJ5  144.14,170.16 0 top
SJ6  144.14,161.27 0 top
U5  169.54,81.26 270 top
U5A  160.9,83.35 0 top
U$1  47.62,126.98 270 top
U$2  156.84,165.08 0 top
U$3  156.84,138.41 0 top
UART/SHAKER  169.86,49.51 90 top
WPC  12.7,167.62 270 top
WPC-J501-AUX-PWR  44.45,10.14 0 top
WPC-J504-CAB-SPK  121.29,10.14 0 top
WPC-J505-BB-SPK  140.97,10.14 0 top

### Tracks (layer width: path | path; a pad name or v marks a point on that pad's centre or on a via)
+3V3  (via drill 0.6)
  Top 0.813: v85.73,91.74 v85.73,85.07
  Bottom 0.406: 114.94,102.85 114.87,102.85 MPU1.P$1
  Bottom 0.813: I2C_3V3.3 153.39,49.51 111.12,49.51 85.73,74.91 v85.73,85.07 | 113.67,102.85 MPU1.P$1 | v85.73,91.74 101.28,91.74 112.4,102.85 114.94,102.85
+5V
  Top 0.406: DISPLAY.6 DISPLAY.2
  Top 1.27: UART/SHAKER.4 164.47,52.05 157.16,44.75 153.71,44.75 I2C_3V3.5
  Bottom 0.813: 126.75,36.56 126.62,36.56 126.37,36.81
  Bottom 1.27: 5V-DC.OUT+.2 5V-DC.OUT+.1 126.75,36.56 134.94,44.75 153.71,44.75 I2C_3V3.5 | 84.14,90.15 38.73,90.15 36.2,92.69 36.2,105.39 38.73,107.93 U$1.5V | 84.14,90.15 90.81,90.15 | U5.VCC 175.89,66.97 173.67,64.75 173.67,53.64 172.08,52.05 UART/SHAKER.4 | DISPLAY.2 90.81,90.15 | U5A.VCC 145.34,97.84 141.6,101.58 117.48,101.58 117.16,101.9 | 90.81,90.15 102.23,90.15 113.03,100.95 116.2,100.95 117.16,101.9 | 84.14,90.15 84.14,72.05 109.54,46.65 116.52,46.65 126.37,36.81 126.68,36.49 | 117.16,101.9 117.48,102.22 117.48,102.75 MPU1.P$2 MPU1.P$4
+12V  (via drill 0.6)
  Top 1.27: 12V-DC.OUT+ 101.09,47.1 127.64,73.64 v127.64,136.5
  Bottom 1.016: 168.59,184.76 168.75,184.61 168.91,184.76 168.91,184.45 U$2.VCC 169.54,184.76 | 144.14,157.46 143.51,156.82
  Bottom 1.27: 5V-DC.IN+.2 5V-DC.IN+.1 108.2,37.19 100.97,46.02 | DE-CN2-POWER.1 12.44,134.6 10.79,134.6 5.71,129.52 5.71,74.91 11.36,69.27 53.27,69.27 56.52,66.02 56.52,59.67 59.05,57.13 C1.+ 70.48,57.13 73.03,54.59 73.03,48.56 75.57,46.02 84.45,46.02 | 84.45,46.02 100.97,46.02 | 100.97,46.02 100.97,45.95 12V-DC.OUT+ | v127.64,136.5 127.64,152.38 132.08,156.82 143.51,156.82 149.86,156.82 151.45,155.24 168.59,155.24 169.54,156.19 U$3.VCC 169.54,158.41 172.08,160.95 CAB-AMP.+12V | 84.51,37.32 84.51,38.03 84.45,46.02 | 168.59,184.76 166.37,184.76 164.47,186.67 164.47,189.21 161.92,191.75 145.41,191.75 144.14,190.48 144.14,157.46 | BB-AMP.+12V 172.08,187.3 169.54,184.76
  Bottom 2.54: J2-12/15V.1 74.86,13.24 84.45,22.84 | PIN2DMD.3 94.06,13.24 84.45,22.84 | 84.45,22.84 84.45,45.2 84.51,37.32
AGND
  Top 0.61: BB-AMP.IN.COM 163.83,168.25 163.19,168.89 | 163.19,168.89 161.29,168.89 160.02,167.62 160.02,165.72 163.83,161.91 CAB-AMP.IN.COM | CAB-AMP.IN.COM 163.83,139.04 162.24,137.46 162.24,118.09 | CABINET.GND 140.33,116.82 141.6,118.09 162.24,118.09 | 162.24,118.09 161.92,117.45 BACKBOX.GND | 163.19,168.89 163.19,170.16 162.56,170.79 U$2.RIN- 156.21,172.7 156.21,177.14 157.48,178.41 U$2.LIN- | U$3.RIN- 156.84,144.12 155.57,145.39 155.57,150.16 157.16,151.74 U$3.LIN- 162.56,151.74 163.83,150.47 CAB-AMP.IN.COM
  Top 0.813: BACKBOX.GND 161.92,114.28 163.83,112.38 163.83,92.06 | 163.83,92.06 163.19,91.42 U5.AGND2 | U5.AGND1 163.19,86.34 163.83,86.98 163.83,92.06
  Bottom 0.813: U5.AGND1 163.19,86.34 168.72,80.81 U5A.GND4 176.01,81.26 175.89,81.26 174.62,79.99 174.62,76.18 175.07,75.73 U5A.GND3
AMP-BBL+
  Top 1.27: L5.2 SJ5.2
  Bottom 1.27: L5.2 151.76,170.16 155.57,173.97 168.59,173.97 172.72,178.41 U$2.LOUT-
AMP-BBL-
  Top 1.27: L6.2 SJ6.2
  Bottom 1.27: L6.2 149.54,161.27 154.3,166.03 154.3,170.16 156.53,172.38 169.54,172.38 172.72,175.88 BB-AMP.OUT.L-
AMP-BBR+
  Top 1.016: 150.5,179.05 BB-AMP.OUT.R+ 150.5,179.37
  Top 1.27: U$2.ROUT- 173.99,170.79 172.08,172.7 172.08,177.78 167.96,181.91 153.03,181.91 150.5,179.37 | L3.2 SJ3.2
  Bottom 1.27: BB-AMP.OUT.R+ 150.5,184.45 147,187.94 L3.2
AMP-BBR-
  Top 1.016: 151.13,175.88 BB-AMP.OUT.R-
  Top 1.27: U$2.ROUT+ 172.72,168.25 169.54,171.43 169.54,176.51 165.73,180.32 155.57,180.32 151.13,175.88 | L4.2 SJ4.2
  Bottom 1.27: BB-AMP.OUT.R- 149.54,175.88 L4.2
AMP-CAB+
  Top 1.27: SJ1.2 L1.2
  Bottom 1.27: CAB-AMP.OUT.L+ 165.1,151.74 163.19,153.65 147.95,153.65 L1.2
AMP-CAB-
  Top 1.27: SJ2.2 L2.2
  Bottom 1.27: L2.2 146.69,145.39 147.95,146.66 168.91,146.66 170.81,149.2 U$3.LOUT+
BB-LIN
  Bottom 0.813: BACKBOX.LIN 167.64,110.18 R5.1 167.64,110.1
BB-LOUT
  Top 0.61: BACKBOX.LOUT 165.73,117.45 165.42,118.09 165.42,134.6 169.86,139.04 169.86,141.58 167,144.44 167,165.4 166.37,166.03 BB-AMP.IN.L 166.37,173.33 164.15,175.88 U$2.LIN+
BB-RIN
  Bottom 0.813: BACKBOX.RIN 170.73,114.37 R4.1 170.81,110.09
BB-ROUT
  Top 0.61: BACKBOX.ROUT 163.83,135.23 168.27,139.68 168.27,140.95 165.42,143.81 165.42,162.22 161.29,166.35 BB-AMP.IN.R
  Bottom 0.61: U$2.RIN+ 158.75,166.98 BB-AMP.IN.R
BBL+  (via drill 0.6)
  Top 1.27: v122.87,172.7 122.87,143.81 129.54,137.14 129.54,111.11 133.35,107.3 133.35,17.12 v134.94,15.54 | L5.1 SJ5.1
  Bottom 1.27: L5.1 140.33,170.16 C11.1 v122.87,172.7 122.87,197.78 130.81,205.72 130.81,218.27 DE-CN4-SPEAKER.5 | v134.94,15.54 134.94,10.23 WPC-J505-BB-SPK.1
BBL-  (via drill 0.6)
  Top 1.27: v125.41,176.51 v125.41,158.73 125.41,144.12 131.44,138.09 131.44,111.74 135.25,107.93 135.25,19.35 v139.06,15.54 | L6.1 SJ6.1
  Bottom 1.27: L6.1 140.33,161.27 C12.1 v125.41,158.73 | v125.41,176.51 125.41,196.19 134.62,205.4 DE-CN4-SPEAKER.4 | v139.06,15.54 139.06,10.21 WPC-J505-BB-SPK.2
BBR+  (via drill 0.6)
  Top 1.27: v122.87,207.94 127.64,203.18 v127.64,190.48 127.64,144.76 133.35,139.04 133.35,112.38 137.16,108.56 137.16,21.25 v142.88,15.54 | L3.1 SJ3.1
  Bottom 1.27: L3.1 140.33,187.94 C9.1 v127.64,190.48 | v142.88,15.54 142.88,10.21 WPC-J505-BB-SPK.3 | v122.87,207.94 122.87,218.29 DE-CN4-SPEAKER.7
BBR-  (via drill 0.6)
  Top 1.27: v126.68,207.62 129.86,204.45 v129.86,176.51 129.86,145.39 135.25,140 135.25,113.01 139.06,109.2 139.06,23.48 v147,15.54 | L4.1 SJ4.1
  Bottom 1.27: L4.1 140.33,179.05 C10.1 v129.86,176.51 | v147,15.54 147,10.23 WPC-J505-BB-SPK.4 | v126.68,207.62 126.68,218.4 DE-CN4-SPEAKER.6
BCK  (via drill 0.6)
  Top 0.406: v121.92,90.47 122.56,91.1 122.56,110.37 MPU1.P$12 | U5A.MP5 177.99,85.89 178.44,86.34 178.44,100.63 177.8,101.26 176.59,101.26 | 176.59,101.26 174.31,101.26 173.35,100.31 173.35,95.55 165.73,87.93 U5.BCK | 176.59,101.26 U5A.MP11
  Bottom 0.406: U5.BCK 163.52,69.51 147.64,69.51 146.37,68.24 144.14,68.24 142.88,69.51 135.58,69.51 121.92,83.17 v121.92,90.47
BUSY  (via drill 0.3)
  Top 0.406: DATAEAST.16 12.7,94.59 12.7,92.69 13.33,92.06 15.24,92.06 22.54,84.75 72.07,84.75 74.61,82.21 115.89,82.21 123.19,89.52 123.19,122.54 v122.56,123.17
  Bottom 0.406: v122.56,123.17 122.56,138.41 118.75,142.22 116.11,142.22 MPU1.P$33
BUT1
  Top 0.406: BUTTON.3 113.67,73.92 | 113.67,73.92 BUTTON.4 | MPU1.P$26 124.46,126.25 124.46,88.25 113.67,77.45 113.67,73.92
CA0
  Top 0.406: WPC.25 12.7,156.19 15.24,156.19 19.05,152.38 19.05,131.42 29.85,120.63 RN3.5
CA1
  Top 0.406: WPC.23 12.7,158.73 15.24,158.73 20.32,153.65 20.32,135.23 29.85,125.71 RN3.7
CA2
  Top 0.406: WPC.21 12.7,161.27 15.24,161.27 21.59,154.92 21.59,139.04 29.85,130.79 RN3.9
CA3
  Top 0.406: WPC.19 12.7,163.81 15.24,163.81 22.86,156.19 22.86,145.39 29.85,138.41 RN5.1
CA4
  Top 0.406: WPC.17 12.7,166.35 15.24,166.35 24.13,157.46 24.13,149.2 29.85,143.49 RN5.3
CAB+  (via drill 0.6)
  Top 1.27: v131.44,104.12 131.44,19.66 v127.32,15.54 | v142.56,212.7 132.72,202.86 v132.72,154.92 | SJ1.1 L1.1
  Bottom 1.27: v131.44,104.12 131.44,129.52 144.14,142.22 144.14,149.84 L1.1 140.33,152.38 C7.1 v132.72,154.92 | v127.32,15.54 127.32,10.23 WPC-J504-CAB-SPK.4 | v142.56,212.7 142.56,218.4 DE-CN4-SPEAKER.2
CAB-  (via drill 0.6)
  Top 1.27: v129.54,107.93 129.54,29.82 v115.25,15.54 | v146.5,212.52 135.25,201.27 135.25,143.49 C8.1 | SJ2.1 L2.1
  Bottom 1.27: v129.54,107.93 129.54,132.69 C8.1 140.33,143.49 L2.1 | v115.25,15.54 115.25,10.23 WPC-J504-CAB-SPK.1 | v146.5,212.52 DE-CN4-SPEAKER.1
CAB-IN
  Bottom 0.813: 146.05,113.01 CABINET.LIN 146.05,110.79 147,109.84 R2.1 R1.1 R3.2
CAB-LOUT
  Top 0.61: U$3.LIN+ 159.07,149.2 161.29,146.98 CAB-AMP.IN.R
  Bottom 0.61: CAB-AMP.IN.R 163.19,142.22 164.47,142.22 CAB-AMP.IN.L | CAB-AMP.IN.R 161.29,131.42 153.03,123.17 147.95,123.17 144.14,119.36 CABINET.LOUT | U$3.RIN+ 160.02,141.58 CAB-AMP.IN.R
D0
  Top 0.406: WPC.15 12.7,168.89 15.24,168.89 25.4,158.73 25.4,153.01 29.85,148.57 RN5.5
  Bottom 0.406: DATAEAST.3 20.32,80.62 29.85,90.15 29.85,105.39 33.66,109.2 33.66,147.3 32.38,148.57 RN5.5
D1  (via drill 0.64)
  Top 0.406: WPC.13 12.7,171.43 15.24,171.43 26.67,160 26.67,156.82 v27.94,155.55 29.85,153.65 RN5.7
  Bottom 0.406: DATAEAST.4 12.7,81.9 19.69,81.9 27.94,90.15 v27.94,155.55
D2  (via drill 0.64)
  Top 0.406: WPC.11 12.7,173.97 15.24,173.97 v26.67,162.54 30.48,158.73 RN5.9
  Bottom 0.406: DATAEAST.5 19.05,83.17 26.67,90.79 v26.67,162.54
D3  (via drill 0.6 pad 0.3)
  Top 0.406: WPC.9 12.7,176.51 15.24,176.51 25.4,166.35 v26.04,166.35 27.31,166.35 RN4.1
  Bottom 0.406: DATAEAST.6 12.7,84.44 18.42,84.44 25.4,91.42 25.4,165.72 v26.04,166.35
D4
  Top 0.406: WPC.7 12.7,179.05 15.24,179.05 22.86,171.43 RN4.3
  Bottom 0.406: DATAEAST.7 17.78,85.7 24.13,92.06 24.13,165.72 29.85,171.43 RN4.3
D5
  Top 0.406: WPC.5 12.7,181.59 15.24,181.59 20.32,176.51 RN4.5
  Bottom 0.406: DATAEAST.8 12.7,86.98 17.15,86.98 22.86,92.69 22.86,169.52 29.85,176.51 RN4.5
D6
  Top 0.406: WPC.3 12.7,184.13 15.24,184.13 17.78,181.59 RN4.7
  Bottom 0.406: DATAEAST.9 16.51,88.25 21.59,93.33 21.59,173.33 29.85,181.59 RN4.7
D7
  Top 0.406: WPC.1 12.7,186.67 RN4.9
  Bottom 0.406: DATAEAST.10 12.7,89.52 15.88,89.52 20.32,93.96 20.32,177.14 29.85,186.67 RN4.9
DOUT  (via drill 0.6)
  Top 0.406: v125.73,81.26 125.73,83.8 126.37,84.44 126.37,138.41 121.29,143.49 121.29,144.76 118.75,147.3 118.75,149.74 MPU1.P$40 117.43,151.11 | U5A.MP0 174.18,90.97 168.27,85.07 U5.DIN
  Bottom 0.406: U5.DIN 164.78,70.78 136.21,70.78 v125.73,81.26
DSP_IN_1
  Bottom 0.406: J1.TIP 170.58,37.84 177.48,44.75 177.48,72.17 U5A.IN_1
DSP_IN_2
  Bottom 0.406: J1.RING 171.85,27.68 172.4,28.24 172.4,38.4 178.44,44.43 178.44,77.45 177.16,78.72 176.91,78.72 U5A.IN_2
GND  (via drill 0.6)
  other vias: 33.66,72.37 38.73,72.37 43.81,72.37 48.89,72.37 53.98,72.37 48.89,76.18 43.81,76.18 38.73,76.18 33.66,76.18 33.66,79.99 38.73,79.99 43.81,79.99 48.89,79.99 53.98,76.18 53.98,79.99 59.05,79.99 59.05,76.18 59.05,72.37 88.27,100.31 75.57,100.31 78.11,100.31 80.65,100.31 83.19,100.31 85.73,100.31 83.19,102.85 80.65,102.85 78.11,102.85 75.57,102.85 75.57,105.39 78.11,105.39 80.65,105.39 83.19,105.39 80.65,107.93 78.11,107.93 75.57,107.93 75.57,110.47 78.11,110.47 85.73,102.85 75.57,113.01 93.34,173.97 106.05,173.97 103.51,173.97 100.97,173.97 98.43,173.97 95.89,173.97 98.43,171.43 100.97,171.43 103.51,171.43 106.05,171.43 106.05,168.89 103.51,168.89 100.97,168.89 98.43,168.89 100.97,166.35 103.51,166.35 106.05,166.35 106.05,163.81 103.51,163.81 95.89,171.43 106.05,161.27 4.45,198.1 6.98,198.1 9.53,198.1 9.53,200.64 6.98,200.64 4.45,200.64 4.45,203.18 6.98,203.18 9.53,203.18 144.14,34.27 146.69,34.27 151.76,39.35 149.22,36.81 146.69,36.81 144.14,36.81 144.14,39.35 149.22,39.35 146.69,39.35 144.14,31.73 4.45,27.92 6.98,27.92 9.53,27.92 9.53,30.46 6.98,30.46 4.45,30.46 4.45,33 6.98,33 9.53,33 169.54,198.1 172.08,198.1 174.62,198.1 174.62,200.64 172.08,200.64 169.54,200.64 169.54,203.18 172.08,203.18 174.62,203.18 121.29,58.4 123.83,58.4 123.83,60.94 121.29,60.94 109.86,85.07 112.4,85.07 109.86,87.61 88.27,70.47 90.81,67.92 93.34,65.39 95.89,62.84 121.29,53.32 126.37,53.32 147.95,53.32 84.45,135.87 87,135.87 89.54,135.87 92.08,135.87 94.62,135.87 81.92,135.87 84.45,138.41 87,138.41 89.54,138.41 92.08,138.41 94.62,138.41 81.92,138.41 47.62,116.82 52.7,111.74 40,99.04 40,96.5 46.35,99.04 51.43,99.04 51.43,96.5 46.35,96.5 18.42,124.44 46.35,110.47 43.18,113.65
  pour Bottom: 0,228.58 0,-0.02 180.34,-0.02 180.34,228.58
  pour Top: 0,228.58 0,-0.02 180.34,-0.02 180.34,228.58
LIN
  Top 0.813: 161.92,94.39 U5.LOUT 159.38,93.96 156.84,91.42 156.84,71.1 155.13,69.38 U5A.OUT2
  Bottom 0.813: R5.2 167.56,97.05 164.47,93.96 U5.LOUT 153.99,93.96 150.81,97.14 R1.2
LRCK  (via drill 0.6)
  Top 0.406: v123.83,85.7 125.09,86.98 125.09,137.14 119.38,142.85 119.38,144.12 118.75,144.76 116.11,144.76 MPU1.P$35 | U5A.MP4 174.18,83.35 170.81,79.99 U5.LRCK
  Bottom 0.406: 166.04,72.05 166.37,71.73 | 166.37,71.73 U5.LRCK | v123.83,85.7 123.83,85.07 136.84,72.05 142.88,72.05 144.14,73.32 146.37,73.32 147.64,72.05 166.04,72.05 | 166.04,72.05 166.37,71.73 | U5A.MP10 177.61,98.59 178.44,97.77 178.44,83.8 178.12,83.48 176.59,83.48 U5A.MP4
N$1  (via drill 0.3)
  Top 0.406: v70.48,124.44 107.32,124.44 108.59,125.71 108.59,130.79 112.4,134.6 116.16,134.6 MPU1.P$28
  Bottom 0.406: U$1.NRST 59.05,113.01 v70.48,124.44
N$2
  Top 0.813: U5A.OUT3 152.59,71.92 154.3,73.64 154.3,94.28 160.97,100.95 R3.1
N$3
  Top 0.406: RN3.4 36.2,118.09 37.46,116.82 43.81,116.82 52.7,107.93 U$1.PC14
N$4
  Bottom 0.406: U5.A3V3 162.56,83.8 163.83,82.53 163.83,80.62 U5.XSMT
N$5
  Top 0.406: U$1.PC15 56.52,110.47 57.78,109.2 57.78,107.93 56.52,106.66 53.98,106.66 52.7,105.39 42.54,105.39 41.27,106.66 38.73,106.66 32.38,113.01 RN3.2
N$6
  Top 0.406: R6.2 41.27,137.14 42.54,135.87 42.54,125.71 52.7,115.55 U$1.PA0
N$7
  Top 0.406: U$1.PA1 52.7,118.09 43.81,126.98 43.81,151.11 38.73,156.19 RN5.8
N$8
  Top 0.406: U$1.PA2 52.7,120.63 45.09,128.25 45.09,152.38 36.2,161.27 RN5.10
N$9
  Bottom 2.54: 47.02,46.31 47.14,46.43 | F1.2A 47.27,38.97 47.14,40.75 47.14,46.43 | 47.14,46.43 B1.AC2
N$10
  Bottom 2.54: F1.1A 51.27,18.14 54.14,15.27 | WPC-J501-AUX-PWR.6 52.37,13.5 54.14,15.27 | WPC-J501-AUX-PWR.7 56.33,13.08 54.14,15.27
N$11
  Bottom 2.54: WPC-J501-AUX-PWR.1 32.57,13.44 34.4,15.27 | WPC-J501-AUX-PWR.2 36.53,13.13 34.4,15.27 | B1.AC1 42.08,43.97 34.4,36.28 34.4,15.27
N$12
  Top 0.406: U$1.PA3 52.7,123.17 46.35,129.52 46.35,156.19 33.66,168.89 RN4.2
N$13
  Top 0.406: U$1.PA4 52.7,125.71 47.62,130.79 47.62,157.46 33.66,171.43 33.66,172.7 32.38,173.97 RN4.4
N$14
  Top 0.406: U$1.PA5 52.7,128.25 48.89,132.06 48.89,158.73 34.92,172.7 34.92,176.51 32.38,179.05 RN4.6
N$15
  Top 0.406: U$1.PA6 52.7,130.79 50.16,133.33 50.16,160 36.2,173.97 36.2,180.32 32.38,184.13 RN4.8
N$16
  Top 0.406: U$1.PA7 53.98,133.33 51.43,135.87 51.43,161.27 37.46,175.24 37.46,184.13 32.38,189.21 RN4.10
N$17
  Top 0.406: RN3.6 32.38,123.17 33.66,124.44 33.66,126.98 37.46,130.79 U$1.PA12
N$18
  Top 0.406: RN5.4 32.38,146.03 37.46,140.95 U$1.PA8
N$19
  Top 0.406: RN3.8 32.38,128.25 37.46,133.33 U$1.PA11
N$20
  Top 0.406: RN3.10 34.92,133.33 37.46,135.87 U$1.PA10
N$21
  Top 0.406: RN5.2 34.92,140.95 37.46,138.41 U$1.PA9
N$22
  Top 0.406: U$1.PB0 53.98,135.87 52.7,137.14 52.7,162.54 43.81,171.43 43.81,217.56 DE-CN3-POT.5
N$23
  Top 0.406: R6.1 33.66,151.11 RN5.6
N$26
  Bottom 1.27: C3.+ C2.+ 52.24,57.28 B1.+ 52.36,46.33 61.21,46.33 12V-DC.IN+
P3V3
  Top 0.406: U$1.P3V3 56.52,146.03 57.78,147.3 57.78,151.11 53.98,154.92 53.98,163.81 47.62,170.16 47.62,217.71 DE-CN3-POT.4
RIN
  Top 0.813: 162.24,88.88 U5.ROUT 160.66,88.88 159.38,87.61 159.38,69.83 156.4,66.84 U5A.OUT1
  Bottom 0.813: R4.2 170.81,99.93 170.81,95.23 164.47,88.88 U5.ROUT 155.57,88.88 147.64,96.82 R2.2
RW  (via drill 0.3)
  Top 0.406: WPC.31 12.7,148.57 15.88,148.57 16.51,147.94 16.51,123.81 26.04,114.28 33.66,114.28 v34.92,115.55
  Bottom 0.406: v34.92,115.55 34.92,124.44 38.73,128.25 U$1.PA15
RX  (via drill 0.6)
  Top 0.406: v120.65,89.2 120.65,90.79 121.92,92.06 121.92,108.47 MPU1.P$10
  Bottom 0.406: v120.65,89.2 120.65,74.95 137.84,58.4 160.66,58.4 165.73,53.32 165.73,50.78 167,49.51 UART/SHAKER.3
SCL  (via drill 0.3, 0.6)
  Top 0.406: U5A.SCL 143.7,92.24 143.19,91.74 v143.19,52.05 | DISPLAY.3 93.34,93.96 | 93.34,93.96 107.32,107.93 114.84,107.93 MPU1.P$5 | 93.34,93.96 36.2,93.96 v33.66,96.5
  Bottom 0.406: I2C_3V3.2 153.39,52.05 v143.19,52.05 118.75,52.05 93.34,77.45 DISPLAY.7 DISPLAY.3 | U$1.PB6 38.73,118.09 36.2,115.55 36.2,109.2 33.66,106.66 v33.66,96.5
SD0  (via drill 0.3)
  Top 0.305: 114.84,115.55 MPU1.P$11
  Top 0.406: v107.32,115.55 114.84,115.55
  Bottom 0.406: U$1.PB2 95.25,140.95 106.05,130.16 106.05,116.82 v107.32,115.55
SD1  (via drill 0.3)
  Top 0.406: MPU1.P$13 114.86,118.02 113.67,116.82 61.62,116.8 59.05,119.36 59.05,123.17 v57.78,124.44
  Bottom 0.406: U$1.PB3 43.81,125.71 45.09,124.44 v57.78,124.44
SD2  (via drill 0.3)
  Top 0.406: v60.96,121.9 62.23,120.63 114.96,120.61 MPU1.P$15
  Bottom 0.406: U$1.PB4 43.81,123.17 45.09,121.9 v60.96,121.9
SD3  (via drill 0.3)
  Top 0.406: MPU1.P$16 117.4,120.7 116.2,119.36 v60.96,119.36
  Bottom 0.406: U$1.PB5 43.81,120.63 45.09,119.36 v60.96,119.36
SD4
  Bottom 0.406: U$1.PB12 43.81,151.11 45.09,149.84 93.34,149.84 112.4,130.79 112.4,125.71 113.67,124.44 115.57,124.44 116.87,123.15 MPU1.P$18
SD5  (via drill 0.3)
  Top 0.406: v111.12,129.52 115.57,129.52 116.84,128.25 117.38,128.25 MPU1.P$22
  Bottom 0.406: U$1.PB13 43.81,148.57 45.09,147.3 93.34,147.3 v111.12,129.52
SD6
  Bottom 0.406: U$1.PB14 43.81,146.03 45.09,144.76 93.34,144.76 109.86,128.25 109.86,114.28 113.67,110.47 114.84,110.47 MPU1.P$7
SD7
  Bottom 0.406: U$1.PB15 38.73,143.49 37.46,144.76 37.46,152.38 38.73,153.65 92.08,153.65 97.16,148.57 114.84,148.57 MPU1.P$37
SDA  (via drill 0.3, 0.6)
  Top 0.406: U5A.SDA 143.7,94.78 141.6,92.69 v141.6,54.59 | DISPLAY.4 v95.89,93.96 99.06,97.14 107.32,105.39 114.89,105.39 | 114.94,105.39 114.89,105.39 | 114.89,105.39 MPU1.P$3
  Bottom 0.406: I2C_3V3.1 153.39,54.59 v141.6,54.59 118.75,54.59 95.89,77.45 DISPLAY.8 DISPLAY.4 | U$1.PB7 38.73,115.55 37.46,114.28 37.46,110.47 38.73,109.2 41.27,109.2 42.54,107.93 42.54,96.5 45.09,93.96 v95.89,93.96
SHK  (via drill 0.6)
  Top 0.406: v124.46,73.64 124.46,84.44 125.73,85.7 125.73,137.77 120.33,143.17 120.33,144.44 118.75,146.03 117.43,146.03 MPU1.P$36
  Bottom 0.406: v124.46,73.64 138.43,59.67 163.19,59.67 168.27,54.59 UART/SHAKER.5
SST0  (via drill 0.3)
  Top 0.406: DATAEAST.12 12.7,89.52 16.51,89.52 22.23,83.8 71.76,83.8 74.3,81.26 116.2,81.26 123.83,88.88 123.83,124.44 v121.29,126.98
  Bottom 0.406: v121.29,126.98 121.29,137.14 118.75,139.68 116.11,139.68 MPU1.P$31
STB
  Top 0.406: DATAEAST.13 15.24,93.33 31.12,109.2 RN3.1
STRB  (via drill 0.3)
  Top 0.406: v69.22,125.71 106.05,125.71 107.32,126.98 107.32,132.06 113.67,138.41 114.84,138.41 MPU1.P$29
  Bottom 0.406: U$1.PB9 43.81,110.47 47.62,114.28 57.78,114.28 v69.22,125.71
SWCLK  (via drill 0.3)
  Top 0.406: v74.3,123.17 107.34,123.15 108.56,123.15 109.86,124.44 109.86,129.52 111.12,130.79 114.84,130.79 MPU1.P$23
  Bottom 0.406: U$1.SWCLK 50.16,107.93 52.7,107.93 53.98,106.66 57.78,106.66 v74.3,123.17
SWDIO  (via drill 0.3)
  Top 0.406: v70.48,121.9 111.15,121.88 111.15,121.97 MPU1.P$19
  Bottom 0.406: U$1.SWDIO 46.35,107.93 47.62,109.2 57.78,109.2 v70.48,121.9
TX  (via drill 0.6)
  Top 0.406: v119.38,87.93 119.38,90.79 121.29,92.69 121.29,106.56 MPU1.P$8
  Bottom 0.406: v119.38,87.93 119.38,74.31 137.2,57.13 158.11,57.13 163.19,52.05 163.19,45.7 164.47,44.43 UART/SHAKER.1
WDEN
  Top 0.406: WPC.29 12.7,151.11 15.24,151.11 17.78,148.57 17.78,127.62 29.85,115.55 RN3.3

### Text on the board
tNames: + | R | - | + | L | - | + | C | - | (C) 2021 www.tiltaudio.com | 1 | 34 | VOLUME CONTROL | MIN | MAX | MIN | MAX | 20 | 1 | SDA | SHAKER | SCL | +5V | +3V3 | RX | GND | GND | +5V | TX | AUX IN | +12V | GND | GND | +12V | - | + | + | L | - | + | R | - | V3.6